# Altium project MSXII_Centre_Console_3.0.PrjPcb
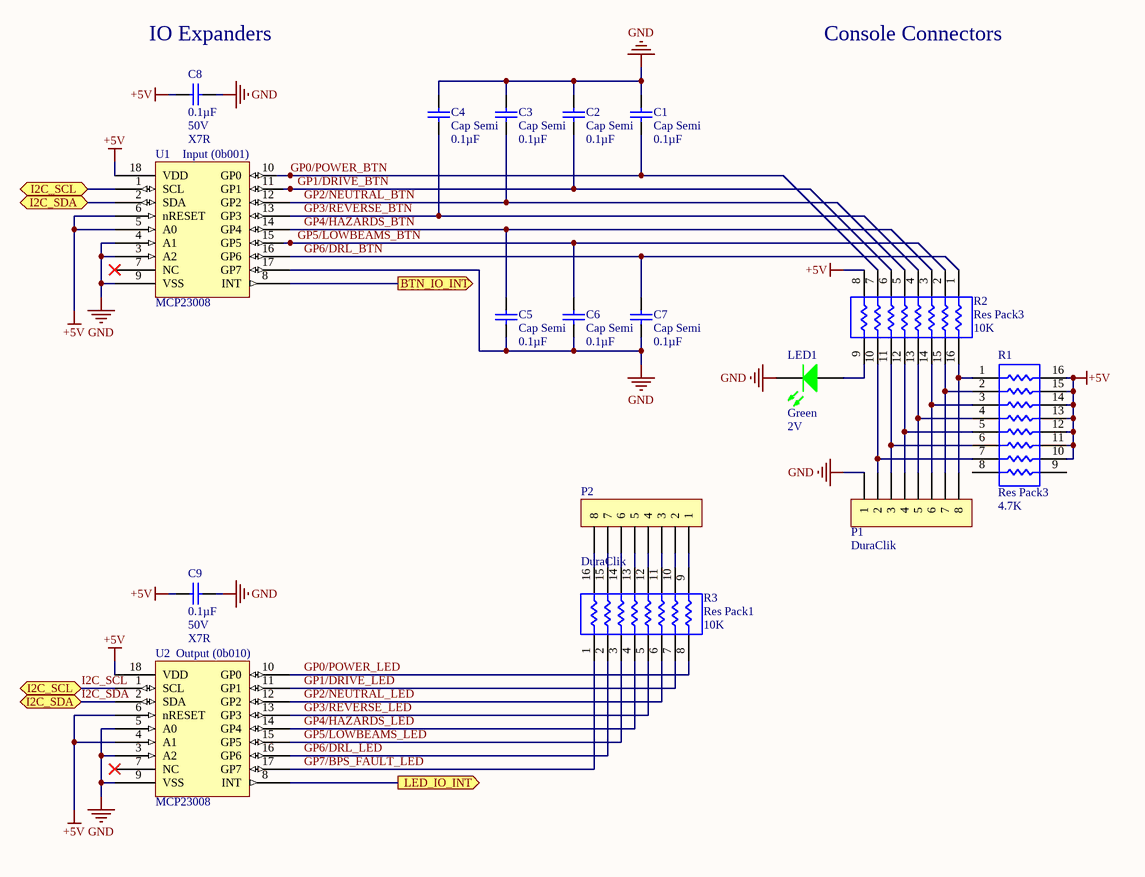
[diagram p0: IO_Expanders.SchDoc]
ProjectRevision: 2.2
2 sheets, 35 parts. Net scope: flat (ports and power ports of the same name join across sheets).
Board file: Centre_Console_3.0.PcbDoc
Sheets:
  IO_Expanders.SchDoc
  Controller_Interface.SchDoc

## Sheet IO_Expanders.SchDoc
size Letter

### Parts
C1  Cap Semi  value 0.1µF  [C1206]
C2  Cap Semi  value 0.1µF  [C1206]
C3  Cap Semi  value 0.1µF  [C1206]
C4  Cap Semi  value 0.1µF  [C1206]
C5  Cap Semi  value 0.1µF  [C1206]
C6  Cap Semi  value 0.1µF  [C1206]
C7  Cap Semi  value 0.1µF  [C1206]
C8  Capacitance: 0.1µF  Voltage: 50V  Temperature Coefficient: X7R  [CAP, 0603]  (hidden comment: CAP CER 0.1UF 50V 10% X7R 0603)
C9  Capacitance: 0.1µF  Voltage: 50V  Temperature Coefficient: X7R  [CAP, 0603]  (hidden comment: CAP CER 0.1UF 50V 10% X7R 0603)
LED1  Color: Green  Voltage - Forward (Vf) (Typ): 2V  [LED_0603]  (hidden comment: LED GREEN CLEAR 2V 0603)
P1  Series: DuraClik  [CONN, 8POS Dura-Clik]  (hidden comment: CONN 8POS DURA-CLIK 0.079")
P2  Series: DuraClik  [CONN, 8POS Dura-Clik]  (hidden comment: CONN 8POS DURA-CLIK 0.079")
R1  Res Pack3  value 4.7K  [SO-16_N]
R2  Res Pack3  value 10K  [SO-16_N]
R3  Res Pack1  value 10K  [SO-16_N]
U1  MCP23008  [IC 18SOIC]
U2  MCP23008  [IC 18SOIC]

### Ports
BTN_IO_INT (out), I2C_SCL (bidir), I2C_SDA (bidir), LED_IO_INT (out)

### Nets
+5V: C8.1 C9.1 R1.10 R1.11 R1.12 R1.13 R1.14 R1.15 R1.16 R2.8 U1.5(A0) U1.6(nRESET) U1.18(VDD) U2.4(A1) U2.6(nRESET) U2.18(VDD)
GND: C1.2 C2.1 C3.1 C4.1 C5.2 C6.2 C7.2 C8.2 C9.2 LED1.2(K) P1.1 U1.3(A2) U1.4(A1) U1.9(VSS) U1.17(GP7) U2.3(A2) U2.5(A0) U2.9(VSS)
GP0/POWER_BTN: C1.1 R2.7 U1.10(GP0)
GP0/POWER_LED: R3.8 U2.10(GP0)
GP1/DRIVE_BTN: C2.2 R2.6 U1.11(GP1)
GP1/DRIVE_LED: R3.7 U2.11(GP1)
GP2/NEUTRAL_BTN: C3.2 R2.5 U1.12(GP2)
GP2/NEUTRAL_LED: R3.6 U2.12(GP2)
GP3/REVERSE_BTN: C4.2 R2.4 U1.13(GP3)
GP3/REVERSE_LED: R3.5 U2.13(GP3)
GP4/HAZARDS_BTN: C5.1 R2.3 U1.14(GP4)
GP4/HAZARDS_LED: R3.4 U2.14(GP4)
GP5/LOWBEAMS_BTN: C6.1 R2.2 U1.15(GP5)
GP5/LOWBEAMS_LED: R3.3 U2.15(GP5)
GP6/DRL_BTN: C7.1 R2.1 U1.16(GP6)
GP6/DRL_LED: R3.2 U2.16(GP6)
GP7/BPS_FAULT_LED: R3.1 U2.17(GP7)
I2C_SCL: U1.1(SCL) U2.1(SCL) ; port I2C_SCL
I2C_SDA: U1.2(SDA) U2.2(SDA) ; port I2C_SDA
PA9: U2.8(INT) ; port LED_IO_INT
PA10: U1.8(INT) ; port BTN_IO_INT
NetLED1_1: LED1.1(A) R2.9
NetP1_2: P1.2 R1.7 R2.10
NetP1_3: P1.3 R1.6 R2.11
NetP1_4: P1.4 R1.5 R2.12
NetP1_5: P1.5 R1.4 R2.13
NetP1_6: P1.6 R1.3 R2.14
NetP1_7: P1.7 R1.2 R2.15
NetP1_8: P1.8 R1.1 R2.16
NetP2_1: P2.1 R3.9
NetP2_2: P2.2 R3.10
NetP2_3: P2.3 R3.11
NetP2_4: P2.4 R3.12
NetP2_5: P2.5 R3.13
NetP2_6: P2.6 R3.14
NetP2_7: P2.7 R3.15
NetP2_8: P2.8 R3.16

Not connected (* = marked no-connect by the designer): R1 8 9; U1 7(NC)*; U2 7(NC)*

### Notes on the sheet
- (near C8) IO Expanders
- Console Connectors
- (near U1) Input (0b001)
- (near U2) Output (0b010)
- Project:
- Title:
- Size:
- Project Author
- Letter
- Revision:
- University of Waterloo
- 200 University Ave W
- Waterloo, ON, Canada
- N2L 3E9
- Date:
- Sheet
- of
- Website:

### Library data of the parts
C1-C7 = Cap Semi: Capacitor (Semiconductor SIM Model); Published: 8-Jun-2000; LatestRevisionDate: 29-May-2009; LatestRevisionNote: IPC-7351 Footprint Added.; PackageReference: C1206; Publisher: Altium Limited; PackageDescription: Chip Capacitor
C8 C9 = CAP CER 0.1UF 50V 10% X7R 0603: 0.10µF ±10% 50V Ceramic Capacitor X7R 0603 (1608 Metric); Manufacturer 1: AVX Corporation; Manufacturer Part Number 1: 06035C104KAT2A; Supplier 1: Digi-Key; Supplier Part Number 1: 478-5052-1-ND; Packaging: Cut Tape (CT); Part Status: Active; Operating Temperature: -55°C ~ 125°C; Ratings: -; Mounting Type: Surface Mount, MLCC; Package / Case: 0603 (1608 Metric); Size / Dimension: 0.063" L x 0.032" W (1.60mm x 0.81mm); Height - Seated (Max): -; Thickness (Max): 0.035" (0.90mm); Lead Spacing: -; Lead Style: -; ComponentLink1URL: http://datasheets.avx.com/X7RDielectric.pdf; ComponentLink1Description: http://datasheets.avx.com/X7RDielectric.pdf; Tolerance: ±10%
LED1 = LED GREEN CLEAR 2V 0603: Green 572nm LED Indication - Discrete 2V 0603 (1608 Metric); Manufacturer: Wurth Electronics Inc.; Manufacturer Part Number: 150060VS75000; Lens Color: Colorless; Millicandela Rating: 40mcd; Lens Style/Size: Rectangle with Flat Top, 1.10mm x 0.70mm; Current - Test: 20mA; Viewing Angle: 140°; Wavelength - Dominant: 570nm; Supplier 1: Digi-Key; RoHS: RoHS Compliant; Category: Optoelectronics; Stock 1: 9408; Pricing 1: 1=0.21, 100=0.1617, 500=0.13964 (CAD); Packaging: Cut Tape (CT); Part Status: Active; Lens Transparency: Clear; Mounting Type: Surface Mount; Wavelength - Peak: 572nm; Features: -; Package / Case: 0603 (1608 Metric); Supplier Device Package: 0603; Size / Dimension: 1.60mm L x 0.80mm W; Height (Max): 0.80mm; ComponentLink1URL: http://katalog.we-online.de/led/datasheet/150060VS75000.pdf; ComponentLink1Description: http://katalog.we-online.de/led/datasheet/150060VS75000.pdf; Supplier Part Number 1: 732-4980-1-ND
P1 P2 = CONN 8POS DURA-CLIK 0.079": 8 Positions Header Connector 0.079" (2.00mm) Surface Mount Tin; Manufacturer 1: Molex, LLC; Manufacturer Part Number 1: 5600200820; Style: Board to Cable/Wire; Shrouding: Shrouded - 4 Wall; Number of Positions: 8; Number of Positions Loaded: All; Mated Stacking Heights: 9.3mm; Supplier 1: Digi-Key; Supplier Part Number 1: WM10868CT-ND; Packaging: Cut Tape (CT); Part Status: Active; Connector Type: Header; Contact Type: Male Pin; Pitch - Mating: 0.079" (2.00mm); Number of Rows: 1; Row Spacing - Mating: -; Mounting Type: Surface Mount; Termination: Solder; Fastening Type: Latch Lock; Contact Length - Mating: -; Contact Length - Post: -; Overall Contact Length: -; Insulation Height: 0.315" (8.00mm); Contact Shape: Square; Contact Finish - Mating: Tin; Contact Finish Thickness - Mating: -; Contact Finish - Post: Tin; Contact Material: Copper Alloy; Insulation Material: Polyamide (PA), Nylon; Operating Temperature: -; Ingress Protection: -; Material Flammability Rating: -; Insulation Color: Natural; Current Rating: -; Contact Finish Thickness - Post: -; ComponentLink1URL: http://www.molex.com/pdm_docs/sd/5600200820_sd.pdf; ComponentLink1Description: http://www.molex.com/pdm_docs/sd/5600200820_sd.pdf; Voltage: -
R1-R3 = Res Pack3: Isolated Resistor Network; Published: 24-Mar-1999; LatestRevisionDate: 29-May-2009; LatestRevisionNote: IPC-7351 Footprint Added.; PackageReference: SO-16; Publisher: Altium Limited; PackageDescription: 16-Pin Small Outline Integrated Circuit 1.27 mm Pitch; Code_JEDEC: MS-012-AC; Code_IPC: SOIC127P600-16
U1 U2 = IC I/O EXPANDER I2C 8B 18SOIC: MCP23008 I/O Expander 8B+1Int 18P SOIC; Manufacturer: Microchip Technology; Manufacturer Part Number: MCP23008T-E/SO; Number of I/O: 8; Interface: I²C; Interrupt Output: Yes; Output Type: Push-Pull; Current - Output Source/Sink: 25mA; Voltage - Supply: 1.8 V ~ 5.5 V; Supplier 1: Digi-Key; Supplier Part Number 1: MCP23008T-E/SOCT-ND; RoHS: RoHS Compliant; Category: Integrated Circuits (ICs); Stock 1: 5607; Pricing 1: 1=1.62, 25=1.3548, 100=1.2431 (CAD); Packaging: Cut Tape (CT); Part Status: Active; Features: POR; Operating Temperature: -40°C ~ 125°C; Mounting Type: Surface Mount; Package / Case: 18-SOIC (0.295", 7.50mm Width); Supplier Device Package: 18-SOIC; ComponentLink1URL: http://www.microchip.com/mymicrochip/filehandler.aspx?ddocname=en021920; ComponentLink1Description: http://www.microchip.com/mymicrochip/filehandler.aspx?ddocname=en021920

## Sheet Controller_Interface.SchDoc
size Letter
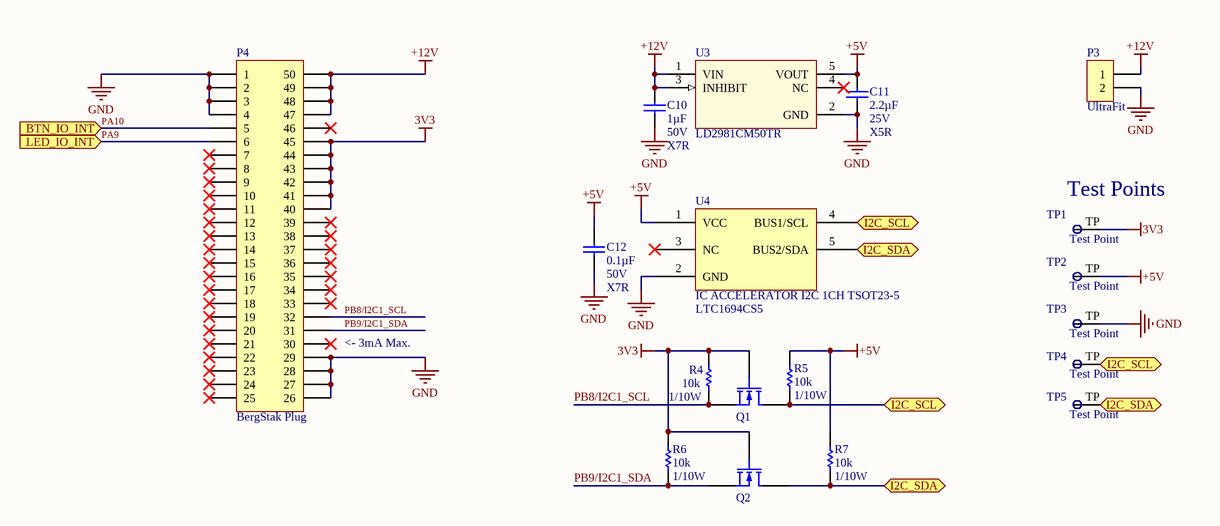
[diagram p1: Controller_Interface.SchDoc]

### Parts
C10  Capacitance: 1µF  Voltage: 50V  Temperature Coefficient: X7R  [CAP, 0603]  (hidden comment: CAP CER 1UF 50V 10% X7R 0603)
C11  Capacitance: 2.2µF  Voltage: 25V  Temperature Coefficient: X5R  [CAP, 0603]  (hidden comment: CAP CER 2.2UF 25V 10% X5R 0603)
C12  Capacitance: 0.1µF  Voltage: 50V  Temperature Coefficient: X7R  [CAP, 0603]  (hidden comment: CAP CER 0.1UF 50V 10% X7R 0603)
P3  Series: UltraFit  [CONN, 2POS ULTRA-FIT]  (hidden comment: CONN 2POS ULTRA-FIT 0.138")
P4  Series: BergStak Plug  [CONN, Bergstak 50 Pos Plug]  (hidden comment: CONN 50POS Bergstak Plug 0.02")
Q1  MOSFET N-CH 60V 4A 3.3W SOT-223  [N-CH MOSFET SOT-23]  (value not drawn)
Q2  MOSFET N-CH 60V 4A 3.3W SOT-223  [N-CH MOSFET SOT-23]  (value not drawn)
R4  Resistance: 10k  Power: 1/10W  [RES, 0603]  (hidden comment: RES 10K OHM 1% 1/10W 0603)
R5  Resistance: 10k  Power: 1/10W  [RES, 0603]  (hidden comment: RES 10K OHM 1% 1/10W 0603)
R6  Resistance: 10k  Power: 1/10W  [RES, 0603]  (hidden comment: RES 10K OHM 1% 1/10W 0603)
R7  Resistance: 10k  Power: 1/10W  [RES, 0603]  (hidden comment: RES 10K OHM 1% 1/10W 0603)
TP1  Test Point  [Test Point]  (no BOM)
TP2  Test Point  [Test Point]  (no BOM)
TP3  Test Point  [Test Point]  (no BOM)
TP4  Test Point  [Test Point]  (no BOM)
TP5  Test Point  [Test Point]  (no BOM)
U3  Manufacturer Part Number 1: LD2981CM50TR  [SOT95P280X145-5N]  (hidden comment: IC REG LDO 5V 0.1A SOT23-5)
U4  IC ACCELERATOR I2C 1CH TSOT23-5  Supplier Part Number: LTC1694CS5  [IC OP AMP GP RR 10MHZ SOT-23-5]

### Ports
BTN_IO_INT (in), I2C_SCL (bidir), I2C_SDA (bidir), LED_IO_INT (in)

### Nets
3V3: P4.40 P4.41 P4.42 P4.43 P4.44 P4.45 Q1.1(G) Q2.1(G) R4.1 R6.2 TP1.TP
+5V: C11.1 C12.1 R5.1 R7.1 TP2.TP U3.5(VOUT) U4.1(VCC)
+12V: C10.1 P3.1 P4.47 P4.48 P4.49 P4.50 U3.1(VIN) U3.3(INHIBIT)
GND: C10.2 C11.2 C12.2 P3.2 P4.1 P4.2 P4.3 P4.4 P4.26 P4.27 P4.28 P4.29 TP3.TP U3.2(GND) U4.2(GND)
I2C_SCL: Q1.3(D) R5.2 TP4.TP U4.4(BUS1/SCL) ; port I2C_SCL
I2C_SDA: Q2.3(D) R7.2 TP5.TP U4.5(BUS2/SDA) ; port I2C_SDA
PA9: P4.6 ; port LED_IO_INT
PA10: P4.5 ; port BTN_IO_INT
PB8/I2C1_SCL: P4.32 Q1.2(S) R4.2
PB9/I2C1_SDA: P4.31 Q2.2(S) R6.1

Not connected (* = marked no-connect by the designer): P4 7* 8* 9* 10* 11* 12* 13* 14* 15* 16* 17* 18* 19* 20* 21* 22* 23* 24* 25* 30* 33* 34* 35* 36* 37* 38* 39* 46*; U3 4(NC)*; U4 3(NC)*

### Notes on the sheet
- (near TP1) Test Points
- (near P4) <- 3mA Max.
- Project:
- Title:
- Size:
- Project Author
- Letter
- Revision:
- University of Waterloo
- 200 University Ave W
- Waterloo, ON, Canada
- N2L 3E9
- Date:
- Sheet
- of
- Website:

### Library data of the parts
C10 = CAP CER 1UF 50V 10% X7R 0603: 1µF ±10% 50V Ceramic Capacitor X7R 0603 (1608 Metric); Manufacturer 1: Taiyo Yuden; Manufacturer Part Number 1: UMK107AB7105KA-T; Supplier 1: Digi-Key; Supplier Part Number 1: 587-3247-1-ND; Packaging: Cut Tape (CT); Part Status: Active; Operating Temperature: -55°C ~ 125°C; Ratings: -; Mounting Type: Surface Mount, MLCC; Package / Case: 0603 (1608 Metric); Size / Dimension: 0.063" L x 0.031" W (1.60mm x 0.80mm); Height - Seated (Max): -; Thickness (Max): 0.037" (0.95mm); Lead Spacing: -; Lead Style: -; ComponentLink1URL: http://www.yuden.co.jp/productdata/catalog/en/mlcc_all_e.pdf; ComponentLink1Description: http://www.yuden.co.jp/productdata/catalog/en/mlcc_all_e.pdf; Tolerance: ±10%
C11 = CAP CER 2.2UF 25V 10% X5R 0603: 2.2µF ±10% 25V Ceramic Capacitor X5R 0603 (1608 Metric); Manufacturer 1: Murata Electronics North America; Manufacturer Part Number 1: GRM188R61E225KA12D; Supplier 1: Digi-Key; Supplier Part Number 1: 490-10731-1-ND; Packaging: Cut Tape (CT); Part Status: Active; Operating Temperature: -55°C ~ 85°C; Ratings: -; Mounting Type: Surface Mount, MLCC; Package / Case: 0603 (1608 Metric); Size / Dimension: 0.063" L x 0.031" W (1.60mm x 0.80mm); Height - Seated (Max): -; Thickness (Max): 0.035" (0.90mm); Lead Spacing: -; Lead Style: -; ComponentLink1URL: http://www.murata.com/~/media/webrenewal/support/library/catalog/products/capacitor/mlcc/c02e.ashx; ComponentLink1Description: http://www.murata.com/~/media/webrenewal/support/library/catalog/products/capacitor/mlcc/c02e.ashx; Tolerance: ±10%
C12 = CAP CER 0.1UF 50V 10% X7R 0603: as C8 on sheet IO_Expanders; Supplier 1: Digi-Key; Supplier Part Number 1: 478-5052-1-ND; Packaging: Cut Tape (CT); Part Status: Active; Operating Temperature: -55°C ~ 125°C; Ratings: -; Mounting Type: Surface Mount, MLCC; Package / Case: 0603 (1608 Metric); Size / Dimension: 0.063" L x 0.032" W (1.60mm x 0.81mm); Height - Seated (Max): -; Thickness (Max): 0.035" (0.90mm); Lead Spacing: -; Lead Style: -; ComponentLink1URL: http://datasheets.avx.com/X7RDielectric.pdf; ComponentLink1Description: http://datasheets.avx.com/X7RDielectric.pdf; Tolerance: ±10%
P3 = CONN 2POS ULTRA-FIT 0.138": 2 Positions Header, Shrouded Connector 0.138" (3.50mm) Through Hole Gold; Manufacturer 1: Molex, LLC; Manufacturer Part Number 1: 1722861302; Style: Board to Board or Cable; Shrouding: Shrouded - 4 Wall; Number of Positions: 2; Number of Positions Loaded: All; Contact Length - Post: 0.126" (3.20mm); Material Flammability Rating: UL94 V-0; Mated Stacking Heights: 26.99mm; Voltage: 400V; Supplier 1: Digi-Key; Supplier Part Number 1: WM11673-ND; Packaging: Tray; Part Status: Active; Connector Type: Header; Contact Type: Male Pin; Pitch - Mating: 0.138" (3.50mm); Number of Rows: 1; Row Spacing - Mating: -; Mounting Type: Through Hole; Termination: Kinked Pin, Solder; Fastening Type: Latch Holder; Contact Length - Mating: -; Overall Contact Length: -; Insulation Height: 0.465" (11.80mm); Contact Shape: Square; Contact Finish - Mating: Gold; Contact Finish Thickness - Mating: 30µin (0.76µm); Contact Finish - Post: Tin; Contact Material: Copper Alloy; Insulation Material: Liquid Crystal Polymer (LCP); Operating Temperature: -40°C ~ 120°C; Ingress Protection: -; Insulation Color: Black; Current Rating: -; Contact Finish Thickness - Post: 60µin (1.52µm); ComponentLink1URL: http://www.molex.com/pdm_docs/sd/1722861302_sd.pdf; ComponentLink1Description: http://www.molex.com/pdm_docs/sd/1722861302_sd.pdf
P4 = CONN 50POS Bergstak Plug 0.02": 50 Position Connector Plug, Outer Shroud Contacts Surface Mount Gold; Manufacturer 1: Amphenol FCI; Manufacturer Part Number 1: 10132797-055100LF; Number of Positions: 50; Mated Stacking Heights: 5mm; Pitch: 0.020" (0.50mm); Supplier 1: Digi-Key; Supplier Part Number 1: 609-5226-1-ND; Packaging: Cut Tape (CT); Part Status: Active; Connector Type: Plug, Outer Shroud Contacts; Number of Rows: 2; Mounting Type: Surface Mount; Contact Finish: Gold; Contact Finish Thickness: 1µin (0.025µm); Height Above Board: 0.169" (4.30mm); ComponentLink1URL: http://portal.fciconnect.com/Comergent//fci/drawing/10132797.pdf; ComponentLink1Description: http://portal.fciconnect.com/Comergent//fci/drawing/10132797.pdf
Q1 Q2 = MOSFET N-CH 60V 4A 3.3W SOT-223: N-Channel 60V 4A (Tc) 3.3W (Tc) Surface Mount SOT-223; Manufacturer 1: STMicroelectronics; Manufacturer Part Number 1: STN3NF06L; Current - Continuous Drain (Id) @ 25°C: 4A (Tc); Drive Voltage (Max Rds On,  Min Rds On): 5V, 10V; Vgs(th) (Max) @ Id: 2.8V @ 250µA; Gate Charge (Qg) (Max) @ Vgs: 9nC @ 5V; Input Capacitance (Ciss) (Max) @ Vds: 340pF @ 25V; Vgs (Max): ±16V; Rds On (Max) @ Id, Vgs: 100 mOhm @ 1.5A, 10V; Supplier 1: Digi-Key; Supplier Part Number 1: 497-3177-1-ND; Packaging: Cut Tape (CT); Part Status: Active; FET Type: N-Channel; Technology: MOSFET (Metal Oxide); Drain to Source Voltage (Vdss): 60V; FET Feature: -; Power Dissipation (Max): 3.3W (Tc); Operating Temperature: -55°C ~ 150°C (TJ); Mounting Type: Surface Mount; Supplier Device Package: SOT-223; Package / Case: TO-261-4, TO-261AA; ComponentLink1URL: http://www.st.com/content/ccc/resource/technical/document/datasheet/b1/52/93/f0/a9/a9/40/d7/CD00002430.pdf/files/CD00002430.pdf/jcr:content/translations/en.CD00002430.pdf; ComponentLink1Description: http://www.st.com/content/ccc/resource/technical/document/datasheet/b1/52/93/f0/a9/a9/40/d7/CD00002430.pdf/files/CD00002430.pdf/jcr:content/translations/en.CD00002430.pdf
R4-R7 = RES 10K OHM 1% 1/10W 0603: RES SMD 10K OHM 1% 1/10W 0603; Manufacturer 1: Yageo; Manufacturer Part Number 1: RC0603FR-0710KL; Temperature Coefficient: ±100ppm/°C; Supplier 1: Digi-Key; Supplier Part Number 1: 311-10.0KHRCT-ND; Packaging: Cut Tape (CT); Part Status: Active; Composition: Thick Film; Operating Temperature: -55°C ~ 155°C; Package / Case: 0603 (1608 Metric); Supplier Device Package: 0603; Size / Dimension: 0.063" L x 0.031" W (1.60mm x 0.80mm); Height - Seated (Max): 0.022" (0.55mm); Failure Rate: -; ComponentLink1URL: http://www.yageo.com/documents/recent/PYu-RC_Group_51_RoHS_L_7.pdf; ComponentLink1Description: http://www.yageo.com/documents/recent/PYu-RC_Group_51_RoHS_L_7.pdf; Tolerance: ±1%
U3 = IC REG LDO 5V 0.1A SOT23-5: Linear Voltage Regulator IC Positive Fixed Output 5V 100mA SOT-23-5; Manufacturer 1: STMicroelectronics; Voltage - Dropout (Typical): 0.18V @ 100mA; Voltage - Input: Up to 16V; Supplier 1: Digi-Key; Supplier Part Number 1: 497-7787-1-ND; Packaging: Cut Tape (CT); Part Status: Active; Regulator Topology: Positive Fixed; Voltage - Output: 5V; Current - Output: 100mA; Current - Limit (Min): -; Operating Temperature: -40°C ~ 125°C; Mounting Type: Surface Mount; Package / Case: SC-74A, SOT-753; Supplier Device Package: SOT-23-5; ComponentLink1URL: http://www.st.com/content/ccc/resource/technical/document/datasheet/group1/b7/b5/a1/83/9c/bd/4a/90/CD00001635/files/CD00001635.pdf/jcr:content/translations/en.CD00001635.pdf; ComponentLink1Description: http://www.st.com/content/ccc/resource/technical/document/datasheet/group1/b7/b5/a1/83/9c/bd/4a/90/CD00001635/files/CD00001635.pdf/jcr:content/translations/en.CD00001635.pdf
U4 = IC ACCELERATOR I2C 1CH TSOT23-5: Accelerator 1 Channel 400kHz TSOT-23-5; Manufacturer: Linear Technology/Analog Devices; Manufacturer Part Number: LTC1694CS5#TRMPBF; Input: 2-Wire Bus; Number of Channels: 1; Voltage - Supply: 2.7 V ~ 6 V; Current - Supply: 60µA; Supplier 1: Digi-Key; RoHS: RoHS Compliant; Category: Integrated Circuits (ICs); Pricing 1: 1=4.79, 25=4.278, 100=2.5493, 250=2.33692 (CAD); Packaging: Cut Tape (CT); Part Status: Active; Type: Accelerator; Applications: I²C; Output: 2-Wire Bus; Data Rate (Max): 400kHz; Delay Time: -; Signal Conditioning: -; Operating Temperature: 0°C ~ 70°C; Package / Case: SOT-23-5 Thin, TSOT-23-5; Supplier Device Package: TSOT-23-5; Base Part Number: LTC1694; ComponentLink1URL: http://www.linear.com/docs/3505; ComponentLink1Description: http://www.linear.com/docs/3505; Supplier Part Number 1: LTC1694CS5#TRMPBFCT-ND; Stock 1: 794

## Nets that join several sheets
+5V: IO_Expanders (16 pins), Controller_Interface (7 pins)
GND: IO_Expanders (18 pins), Controller_Interface (15 pins)
I2C_SCL: IO_Expanders (U1.1 U2.1), Controller_Interface (Q1.3 R5.2 TP4.TP U4.4)
I2C_SDA: IO_Expanders (U1.2 U2.2), Controller_Interface (Q2.3 R7.2 TP5.TP U4.5)
PA9: IO_Expanders (U2.8), Controller_Interface (P4.6)
PA10: IO_Expanders (U1.8), Controller_Interface (P4.5)